# EAGLE schematic DCF77_RX_1V0 (EAGLE 7.7.0)
UFBmod - the best digital modulation ever created :-)
Assembly variants: Std

## Sheet 1 of 4: Signal entry / n-FET
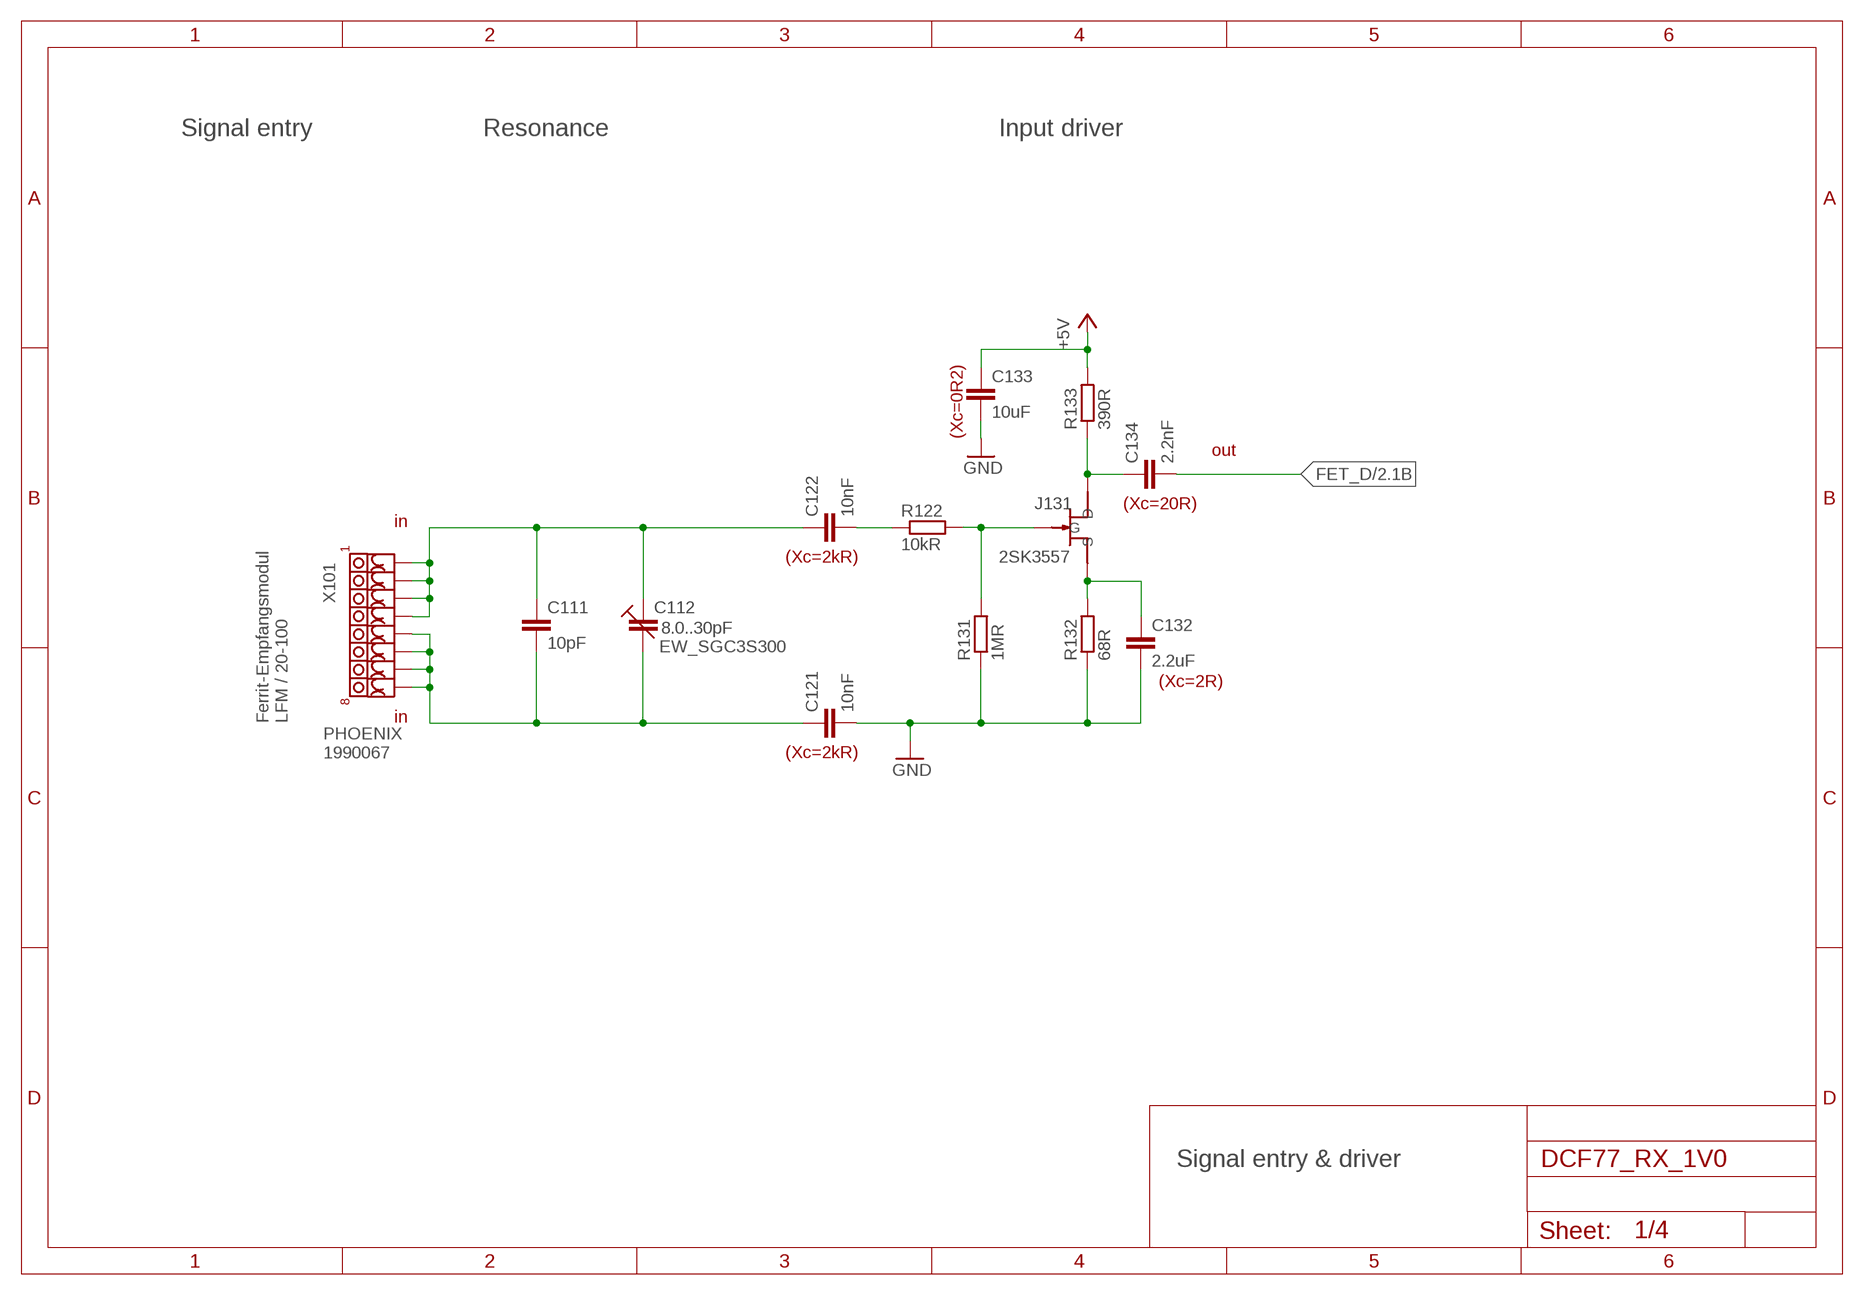
[diagram p0: schematic, sheet 1]

### Parts
C111  10pF  C-EUC0402  [C0402]
C112  EW_SGC3S300  C-TRIMM__EW_SGC3S  [4MM5_X_3MM2__EW_SGC3S]
C121  10nF  C-EUC0805  [C0805]
C122  10nF  C-EUC0805  [C0805]
C132  2.2uF  C-EUC0805  [C0805]
C133  10uF  C-EUC0805  [C0805]
C134  2.2nF  C-EUC0805  [C0805]
J131  2SK3557  2SK3557_N-JFET  [SOT23-3]
R122  10kR  R-EU_R0805  [R0805]
R131  1MR  R-EU_R0805  [R0805]
R132  68R  R-EU_R0805  [R0805]
R133  390R  R-EU_R0805  [R0805]
X101  PHOENIX_1990067_1X8X2MM50_PTSA-0-5  [PHOENIX_1990067_1X8X2MM50_PTSA-0-5]

### Nets
+5V: C133.1 R133.2 ; also sheet 2,3
FET_D: C134.2 ; also sheet 2
GND: C121.2 C132.2 C133.2 R131.1 R132.1 ; also sheet 2,3,4
N101: C111.2 C112.CSTAT C121.1 X101.5 X101.6 X101.7 X101.8
N102: C111.1 C112.CROT C122.1 X101.1 X101.2 X101.3 X101.4
N122: C122.2 R122.1
N131: J131.P$3(G) R122.2 R131.2
N132: C132.1 J131.P$1(S) R132.2
N133: C134.1 J131.P$2(D) R133.1

### Notes on the sheet
- Signal entry | Resonance | Input driver
- (Xc=0R2)
- out
- (Xc=20R)
- in
- (Xc=2kR)
- 8.0..30pF
- (Xc=2R)
- Ferrit-Empfangsmodul
  LFM / 20-100
- in
- PHOENIX 
  1990067
- (Xc=2kR)
- Signal entry & driver

## Sheet 2 of 4: Crystal & Amp
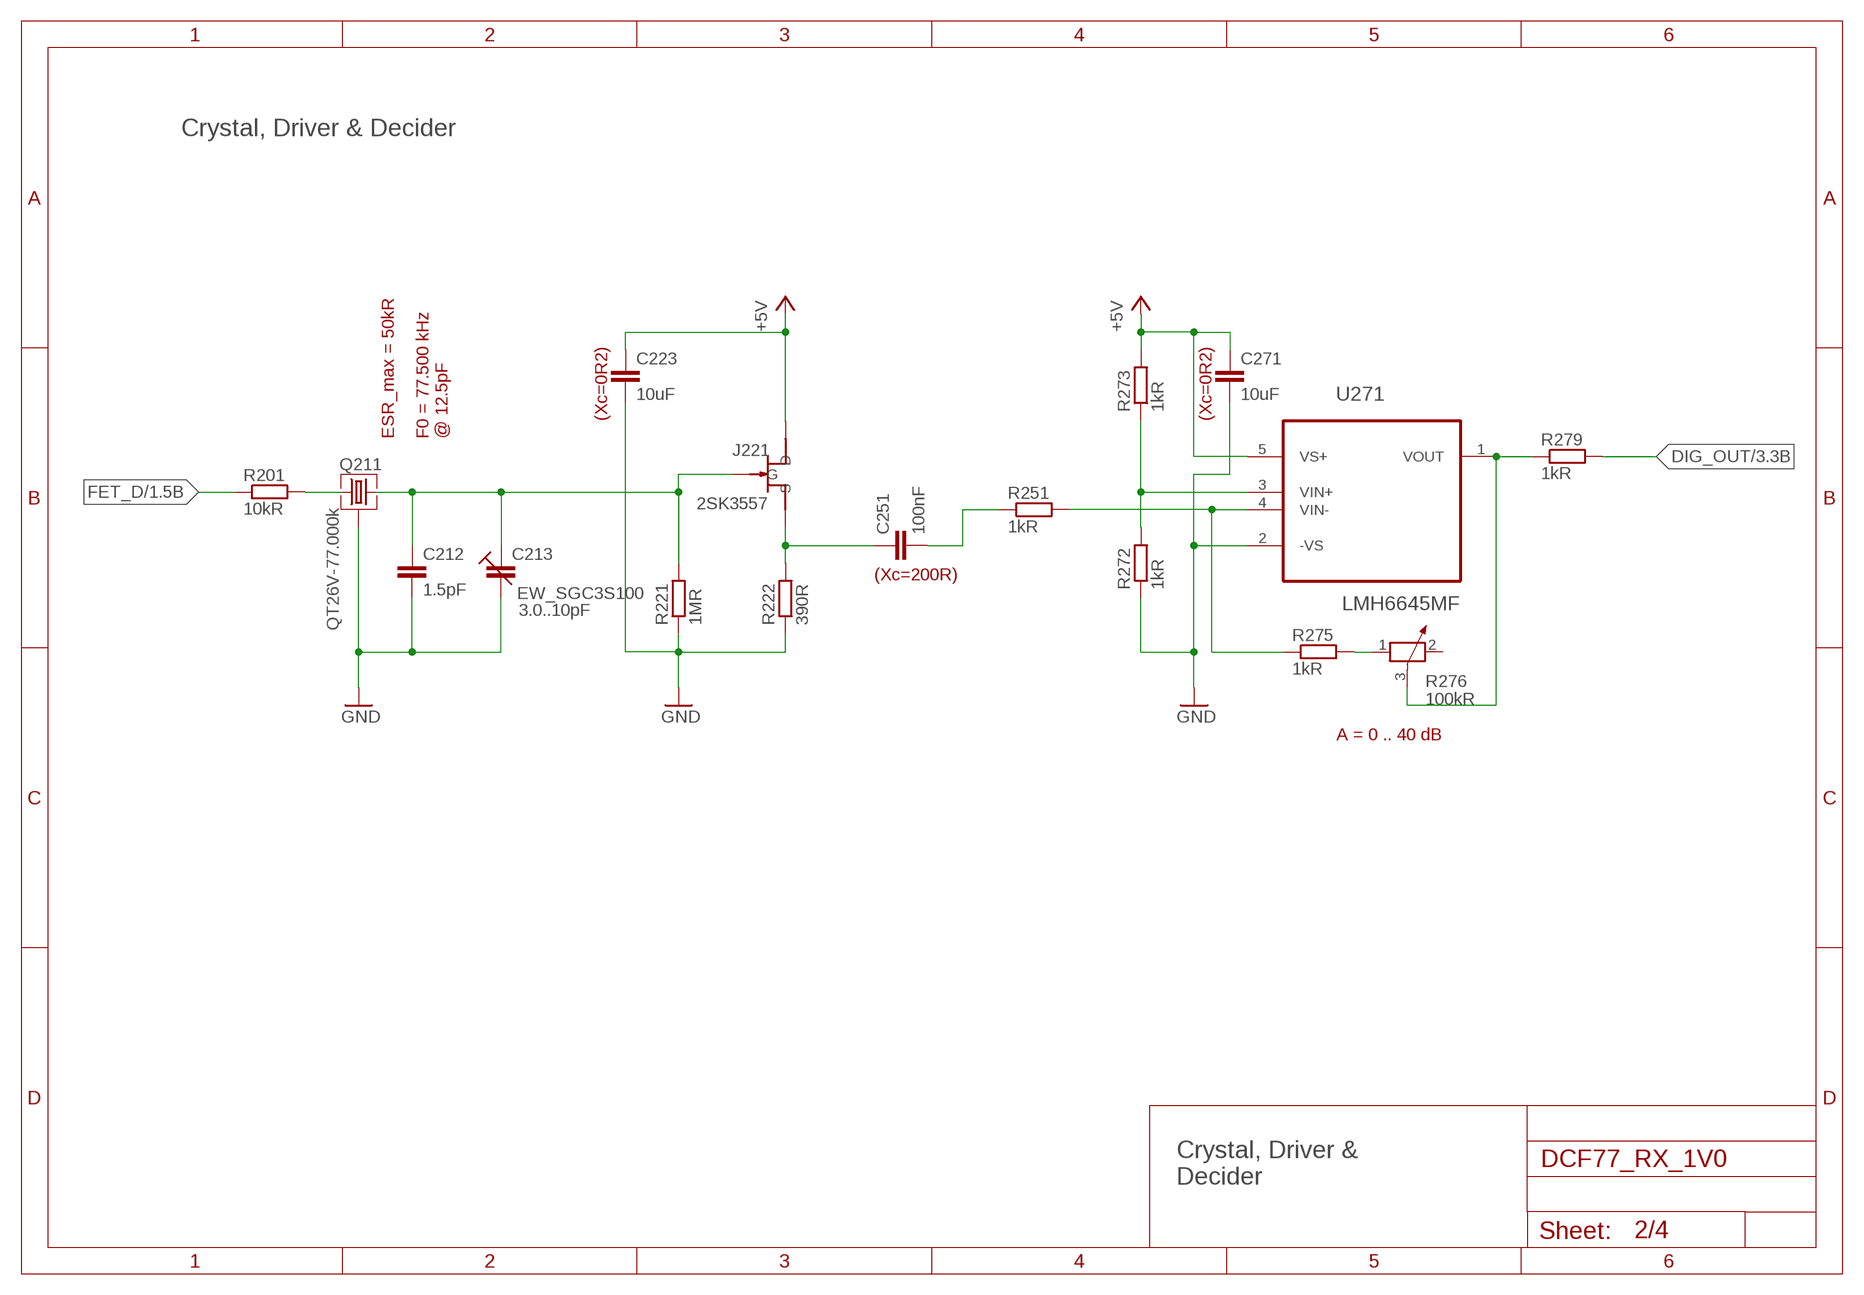
[diagram p1: schematic, sheet 2]

### Parts
C212  1.5pF  C-EUC0402  [C0402]
C213  EW_SGC3S100  C-TRIMM__EW_SGC3S  [4MM5_X_3MM2__EW_SGC3S]
C223  10uF  C-EUC0805  [C0805]
C251  100nF  C-EUC0805  [C0805]
C271  10uF  C-EUC0805  [C0805]
J221  2SK3557  2SK3557_N-JFET  [SOT23-3]
Q211  QT26V-77.000k  QST_QT26V_77.5KHZ  [QT26V_QST]
R201  10kR  R-EU_R0805  [R0805]
R221  1MR  R-EU_R0805  [R0805]
R222  390R  R-EU_R0805  [R0805]
R251  1kR  R-EU_R0805  [R0805]
R272  1kR  R-EU_R0805  [R0805]
R273  1kR  R-EU_R0805  [R0805]
R275  1kR  R-EU_R0805  [R0805]
R276  100kR  POTENTIOMETER_PT-10  [PT-10]
R279  1kR  R-EU_R0805  [R0805]
U271  LMH6645MF  [SOT-23-5]

### Nets
+5V: C223.1 C271.1 J221.P$2(D) R273.2 U271.5(VS+) ; also sheet 1,3
DIG_OUT: R279.2 ; also sheet 3
FET_D: R201.1 ; also sheet 1
GND: C212.2 C213.CSTAT C223.2 C271.2 Q211.3 Q211.4 R221.1 R222.1 R272.1 U271.2(-VS) ; also sheet 1,3,4
N211: Q211.1 R201.2
N221: C212.1 C213.CROT J221.P$3(G) Q211.2 R221.2
N222: C251.1 J221.P$1(S) R222.2
N251: C251.2 R251.1
N271: R276.3 R279.1 U271.1(VOUT)
N272: R272.2 R273.1 U271.3(VIN+)
N273: R251.2 R275.1 U271.4(VIN-)
N275: R275.2 R276.1
Unconnected: R276.2

### Notes on the sheet
- Crystal, Driver & Decider
- (Xc=0R2) | (Xc=0R2)
- ESR_max = 50kR
- F0 = 77.500 kHz
  @ 12.5pF
- (Xc=200R)
- 3.0..10pF
- A = 0 .. 40 dB
- Crystal, Driver &
  Decider

## Sheet 3 of 4: Signal output
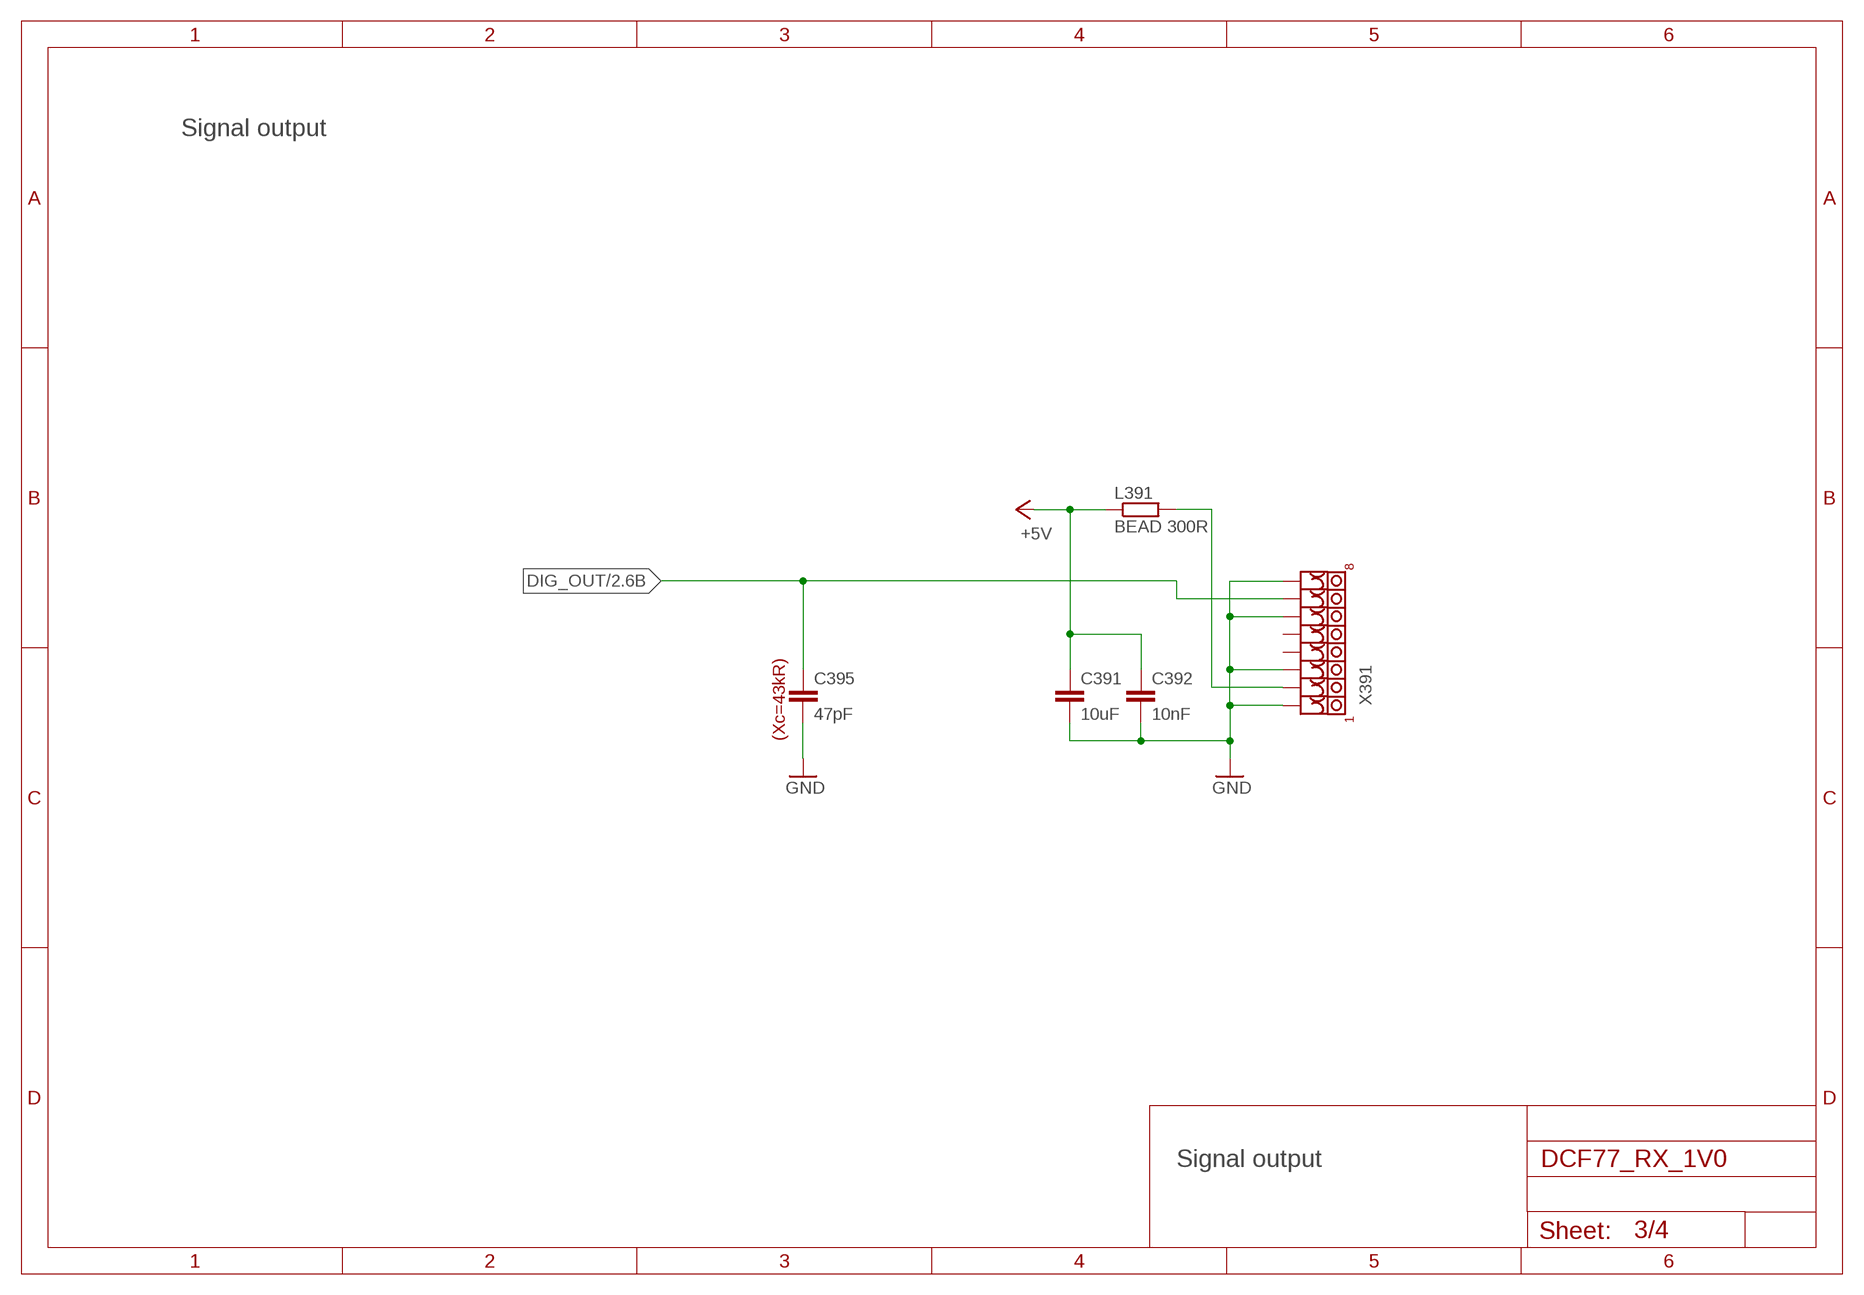
[diagram p2: schematic, sheet 3]

### Parts
C391  10uF  C-EUC0805  [C0805]
C392  10nF  C-EUC0805  [C0805]
C395  47pF  C-EUC0805  [C0805]
L391  BEAD 300R  R-EU_R1206  [R1206]
X391  PHOENIX_1990067_1X8X2MM50_PTSA-0-5  [PHOENIX_1990067_1X8X2MM50_PTSA-0-5]

### Nets
+5V: C391.1 C392.1 L391.1 ; also sheet 1,2
DIG_OUT: C395.1 X391.7 ; also sheet 2
GND: C391.2 C392.2 C395.2 X391.1 X391.3 X391.6 X391.8 ; also sheet 1,2,4
N391: L391.2 X391.2
Unconnected: X391.4 X391.5

### Notes on the sheet
- Signal output
- (Xc=43kR)
- Signal output

## Sheet 4 of 4: Mounting holes
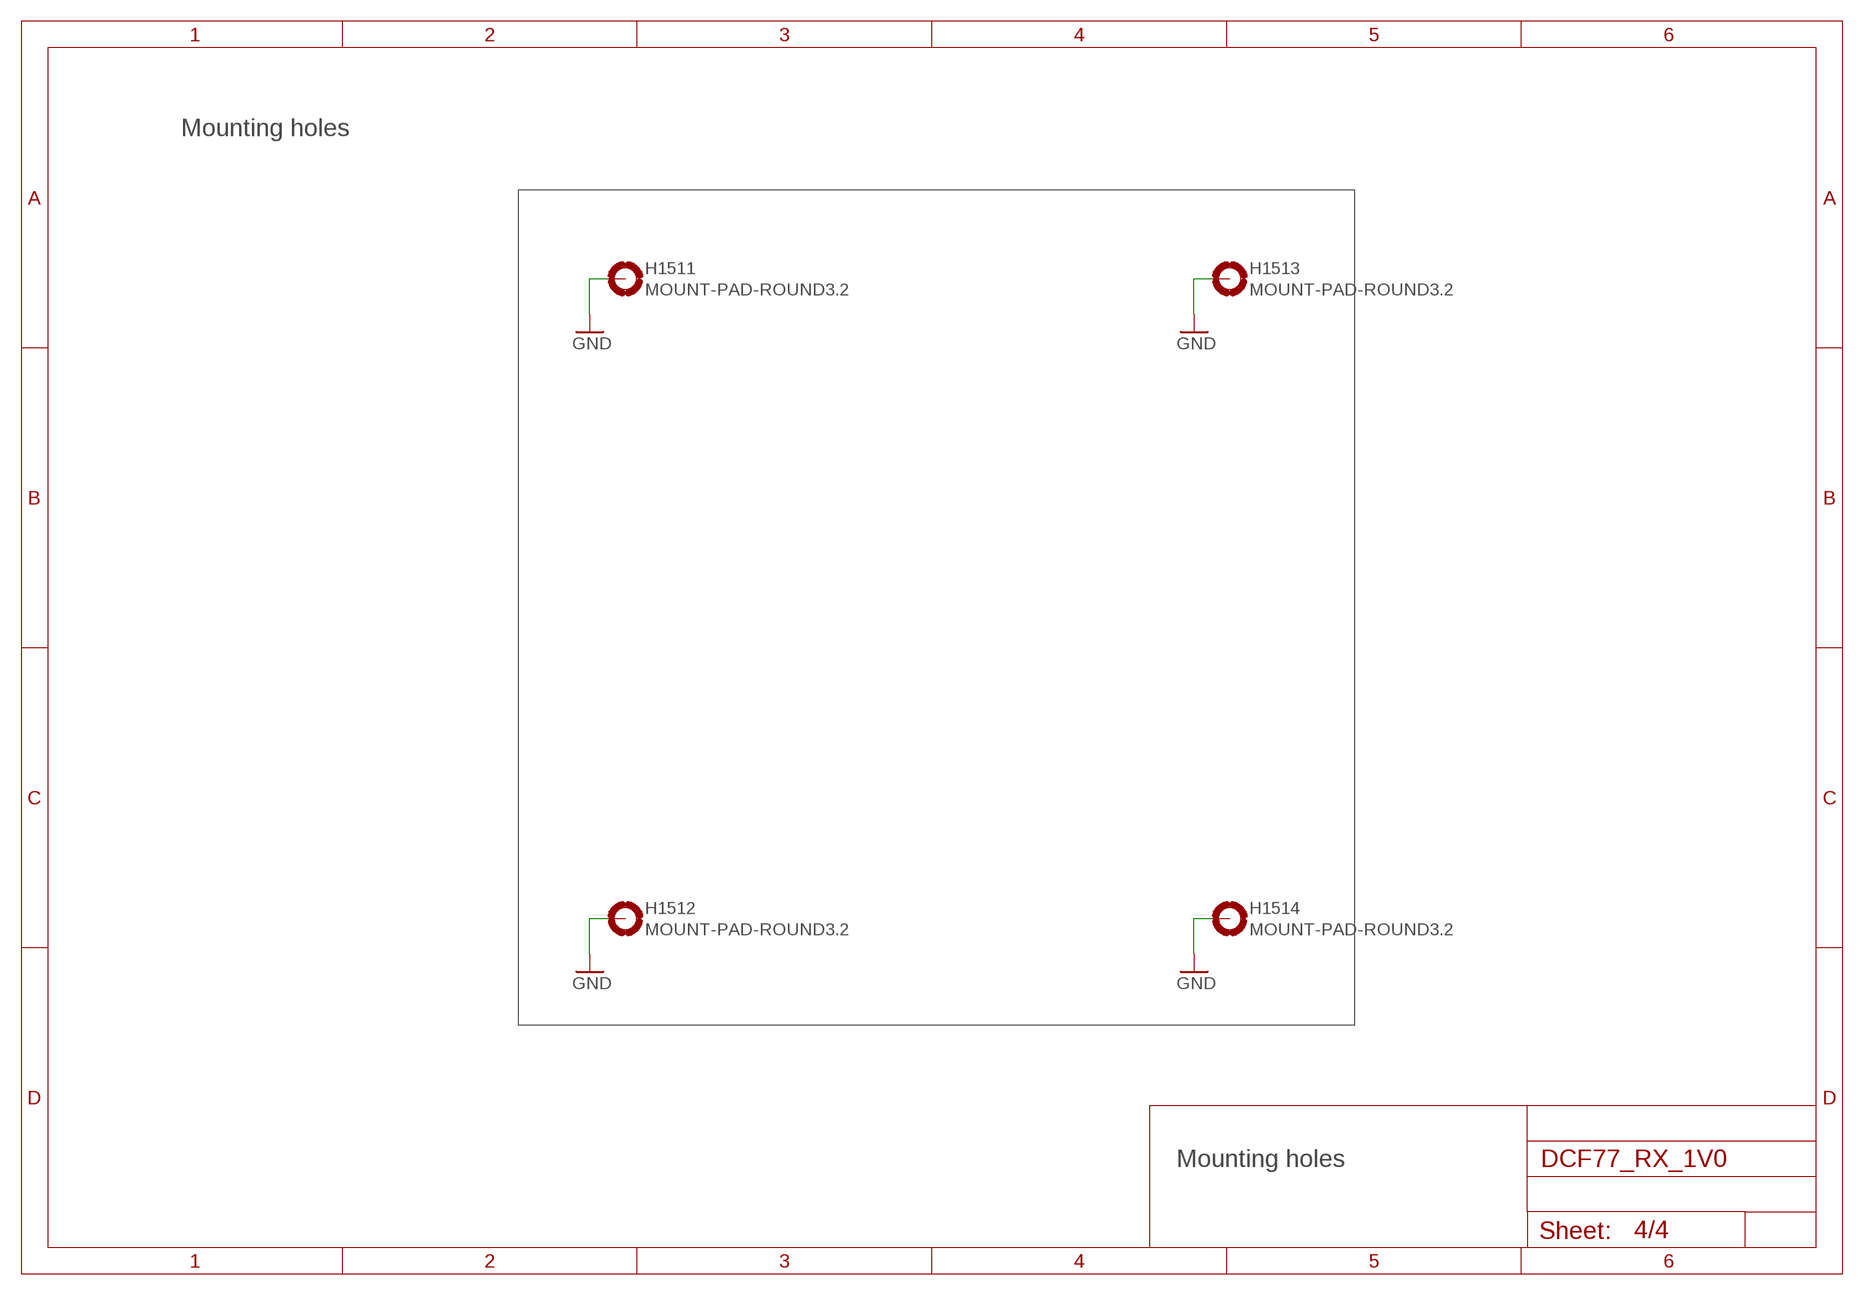
[diagram p3: schematic, sheet 4]

### Parts
H1511  MOUNT-PAD-ROUND3.2  [3,2-PAD]
H1512  MOUNT-PAD-ROUND3.2  [3,2-PAD]
H1513  MOUNT-PAD-ROUND3.2  [3,2-PAD]
H1514  MOUNT-PAD-ROUND3.2  [3,2-PAD]

### Nets
GND: H1511.B3,2(MOUNT) H1512.B3,2(MOUNT) H1513.B3,2(MOUNT) H1514.B3,2(MOUNT) ; also sheet 1,2,3

### Notes on the sheet
- Mounting holes
- Mounting holes

## Library data of the parts
C111 C121 C122 C132-C134 C212 C223 C251 C271 C391 C392 C395 = df4iah_rcl:C-EU: CAPACITOR, European symbol
C112 C213 = df4iah_c-trimm:C-TRIMM__EW_SGC3S: Trimm capacitor SMD - EW SGC3S 4.5 mm x 3.2 mm
H1511-H1514 = df4iah_holes:MOUNT-PAD-ROUND: MOUNTING PAD, round
J131 J221 = df4iah_jfet:2SK3557_N-JFET: 2SK3557 n-channel JFET
L391 R122 R131-R133 R201 R221 R222 R251 R272 R273 R275 R279 = df4iah_rcl:R-EU_: RESISTOR, European symbol
Q211 = df4iah_crystal:QST_QT26V_77.5KHZ: Crystal - QST QT26V 77.500 kHz
R276 = df4iah_rcl:POTENTIOMETER_: Potentiometer
U271 = df4iah_opamp:LMH6645MF: Wideband, Fixed Gain, JFET-Input AMPLIFIER; OC_FARNELL: 1312813; OC_NEWARK: -; PACKAGE: SOT-23-5; SUPPLIER: Texas Instruments
X101 X391 = df4iah_connector:PHOENIX_1990067_1X8X2MM50_PTSA-0-5: PCB terminal block - PTSA 0,5/8-2,5-Z - 1990067 PCB terminal block, nominal current: 2 A, nom. voltage: 250 V, pitch: 2.5 mm, number of positions: 8, connection method: Push-in spring connection, mounting: Wave soldering, conductor/PCB connection direction: 45 °

## Net classes
0 default: width 0.127 mm, drill 0.3 mm, clearance 0.127 mm
1 diff_100R_200u: width 0.203 mm, drill 0.3 mm, clearance 0.203 mm
2 diff_100R_280u: width 0.229 mm, drill 0.3 mm, clearance 0.152 mm
3 diff_100R_360u: width 0.267 mm, drill 0.3 mm, clearance 0.152 mm
4 diff_90R_200u: width 0.216 mm, drill 0.3 mm, clearance 0.152 mm
5 diff_90R_280u: width 0.292 mm, drill 0.3 mm, clearance 0.152 mm
6 diff_90R_360u: width 0.318 mm, drill 0.3 mm, clearance 0.127 mm
7 uni_50R_200u: width 0.343 mm, drill 0.3 mm, clearance 0.381 mm
8 uni_50R_280u: width 0.483 mm, drill 0.3 mm, clearance 0.381 mm
9 uni_50R_360u: width 0.635 mm, drill 0.3 mm, clearance 0.381 mm
10 diff_50R_200u: width 0.508 mm, drill 0.3 mm, clearance 0.127 mm